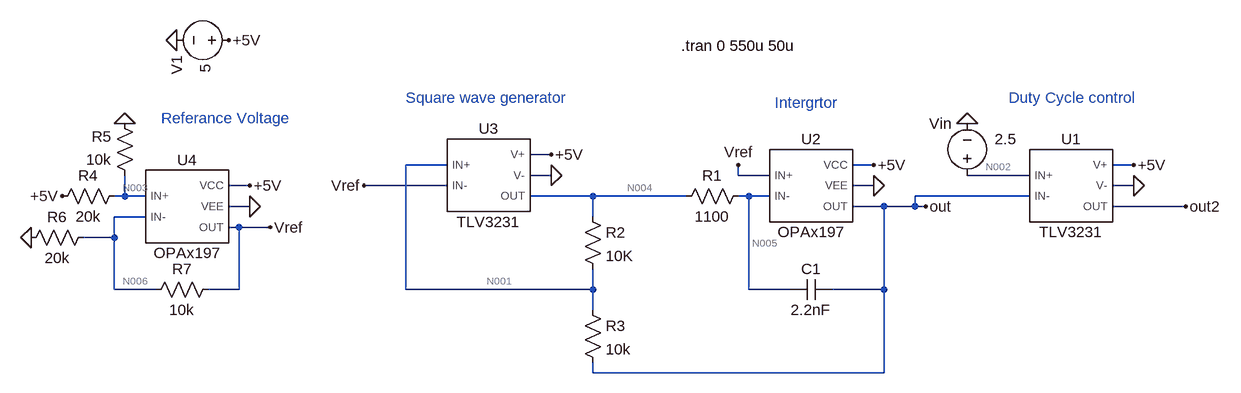
[diagram p0: schematic PWM Control Circiut Simulation.asc]
PWM Control Circiut Simulation.asc, the LTspice schematic file:
Version 4
SHEET 1 1208 680
WIRE 160 112 128 112
WIRE 0 128 -64 128
WIRE 656 128 624 128
WIRE 1056 128 1024 128
WIRE 160 144 128 144
WIRE 448 144 448 128
WIRE 496 144 448 144
WIRE 896 144 800 144
WIRE -304 160 -336 160
WIRE 0 160 -128 160
WIRE 656 160 624 160
WIRE 1056 160 1024 160
WIRE -496 176 -496 144
WIRE -496 176 -512 176
WIRE -464 176 -496 176
WIRE 224 176 128 176
WIRE 368 176 224 176
WIRE 464 176 448 176
WIRE 496 176 464 176
WIRE 896 176 720 176
WIRE -304 192 -336 192
WIRE 672 192 624 192
WIRE 720 192 720 176
WIRE 720 192 672 192
WIRE 736 192 720 192
WIRE 1136 192 1024 192
WIRE -464 208 -512 208
WIRE 224 208 224 176
WIRE -320 224 -336 224
WIRE -272 224 -320 224
WIRE -512 240 -512 208
WIRE -512 240 -560 240
WIRE -512 320 -512 240
WIRE -448 320 -512 320
WIRE -320 320 -320 224
WIRE -320 320 -368 320
WIRE -64 320 -64 128
WIRE 224 320 224 288
WIRE 224 320 -64 320
WIRE 464 320 464 176
WIRE 528 320 464 320
WIRE 672 320 672 192
WIRE 672 320 592 320
WIRE 224 352 224 320
WIRE 224 448 224 432
WIRE 672 448 672 320
WIRE 672 448 224 448
FLAG -416 -64 0
FLAG 736 192 out
FLAG 800 64 0
FLAG 1056 160 0
FLAG 1136 192 out2
FLAG 160 144 0
FLAG -336 -64 +5V
FLAG 160 112 +5V
FLAG 656 160 0
FLAG 656 128 +5V
FLAG 1056 128 +5V
FLAG -272 224 Vref
FLAG -128 160 Vref
FLAG 448 128 Vref
FLAG -304 192 0
FLAG -304 160 +5V
FLAG -496 64 0
FLAG -592 176 +5V
FLAG -640 240 0
SYMBOL OPAx197 560 160 R0
SYMATTR InstName U2
SYMBOL voltage -320 -64 R90
WINDOW 0 24 96 Left 2
WINDOW 3 37 52 Left 2
WINDOW 123 0 0 Left 0
WINDOW 39 0 0 Left 0
SYMATTR InstName V1
SYMATTR Value 5
SYMBOL cap 592 304 R90
WINDOW 0 0 32 VBottom 2
WINDOW 3 32 32 VTop 2
SYMATTR InstName C1
SYMATTR Value 2.2nF
SYMBOL res 464 160 R90
WINDOW 0 0 56 VBottom 2
WINDOW 3 32 56 VTop 2
SYMATTR InstName R1
SYMATTR Value 1100
SYMBOL TLV3231 960 160 R0
SYMATTR InstName U1
SYMBOL voltage 800 160 R180
WINDOW 0 24 96 Left 2
WINDOW 3 -76 72 Left 2
WINDOW 123 0 0 Left 0
WINDOW 39 0 0 Left 0
SYMATTR InstName Vin
SYMATTR Value 2.5
SYMBOL TLV3231 64 144 R0
SYMATTR InstName U3
SYMBOL res 208 192 R0
SYMATTR InstName R2
SYMATTR Value 10K
SYMBOL res 208 336 R0
SYMATTR InstName R3
SYMATTR Value 10k
SYMBOL OPAx197 -400 192 R0
SYMATTR InstName U4
SYMBOL res -496 160 R90
WINDOW 0 0 56 VBottom 2
WINDOW 3 32 56 VTop 2
SYMATTR InstName R4
SYMATTR Value 20k
SYMBOL res -480 160 R180
WINDOW 0 36 76 Left 2
WINDOW 3 36 40 Left 2
SYMATTR InstName R5
SYMATTR Value 10k
SYMBOL res -544 224 R90
WINDOW 0 0 56 VBottom 2
WINDOW 3 32 56 VTop 2
SYMATTR InstName R6
SYMATTR Value 20k
SYMBOL res -464 336 R270
WINDOW 0 32 56 VTop 2
WINDOW 3 0 56 VBottom 2
SYMATTR InstName R7
SYMATTR Value 10k
TEXT 360 -56 Left 2 !.tran 0 550u 50u
TEXT 864 24 Left 2 ;Duty Cycle control
TEXT 504 32 Left 2 ;Intergrtor
TEXT -64 24 Left 2 ;Square wave generator
TEXT -440 56 Left 2 ;Referance Voltage

The netlist it stands for:
* PWM Control Circiut Simulation.asc
XU2 Vref N005 +5V 0 out OPAx197  ; pins IN+ IN- VCC VEE OUT
V1 +5V 0 5
C1 out N005 2.2nF
R1 N005 N004 1100
XU1 N002 out +5V 0 out2 TLV3231  ; pins IN+ IN- V+ V- OUT
Vin N002 0 2.5
XU3 N001 Vref +5V 0 N004 TLV3231  ; pins IN+ IN- V+ V- OUT
R2 N004 N001 10K
R3 N001 out 10k
XU4 N003 N006 +5V 0 Vref OPAx197  ; pins IN+ IN- VCC VEE OUT
R4 N003 +5V 20k
R5 N003 0 10k
R6 N006 0 20k
R7 N006 Vref 10k
.tran 0 550u 50u
* Duty Cycle control
* Intergrtor
* Square wave generator
* Referance Voltage
.lib C:\Users\Jabro\Documents\Perosnal Projects\PWM-Control-\Spice Components models\OPAx197.LIB
.lib C:\Users\Jabro\Documents\Perosnal Projects\PWM-Control-\Spice Components models\tlv3231.lib
.backanno
.end

* Results of the author's LTspice run, read from the files saved beside the schematic
* Operating Point, zero values left out:
*   V(out) = 4.988 V
*   V(+5v) = 5 V
*   V(vref) = 2.5 V
*   V(n005) = 15.2 mV
*   V(n004) = 15.17 mV
*   V(n002) = 2.5 V
*   V(n001) = 2.502 V
*   V(n003) = 1.667 V
*   V(n006) = 1.667 V
*   I(R1) = 24.86 nA
*   I(R2) = -248.6 µA
*   I(R3) = -248.6 µA
*   I(R4) = -166.7 µA
*   I(R5) = 166.7 µA
*   I(R6) = 83.33 µA
*   I(R7) = -83.33 µA
*   I(V1) = -2.899 mA
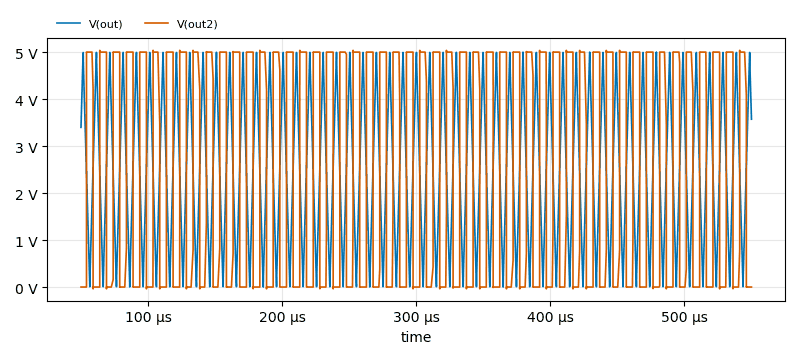
[diagram p1: Transient Analysis of PWM Control Circiut Simulation.asc, plotted from the saved traces]
* Transient Analysis, 1 run:
*   V(out): min -144.1 µV, max 5.001 V, average 2.51 V, rms 2.941 V, last 3.562 V
*   V(out2): min -37.4 mV, max 5.037 V, average 2.486 V, rms 3.525 V, last 0 V